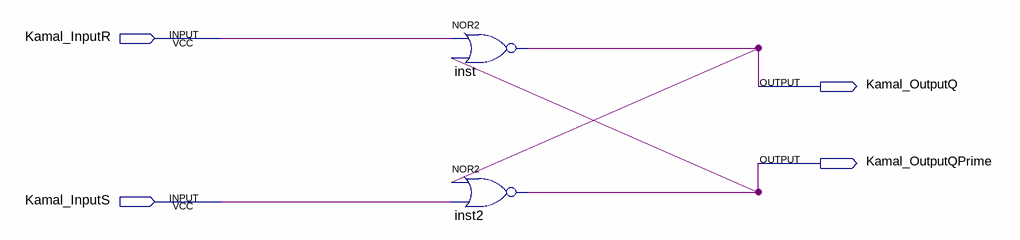
[diagram p0: schematic sheet]
// Quartus schematic Kamal_Faheem_SRAMLab.bdf as structural Verilog: 2 symbols, 4 pins
module Kamal_Faheem_SRAMLab (
  input  Kamal_InputR,
  input  Kamal_InputS,
  output Kamal_OutputQ,
  output Kamal_OutputQPrime
);

  nor inst (Kamal_OutputQ, Kamal_InputR, Kamal_OutputQPrime);
  nor inst2 (Kamal_OutputQPrime, Kamal_OutputQ, Kamal_InputS);
endmodule
